# Altium schematic sheet PCB_DoAn_DK_nhietdo_dht11_ds18b20.SchDoc
size A0
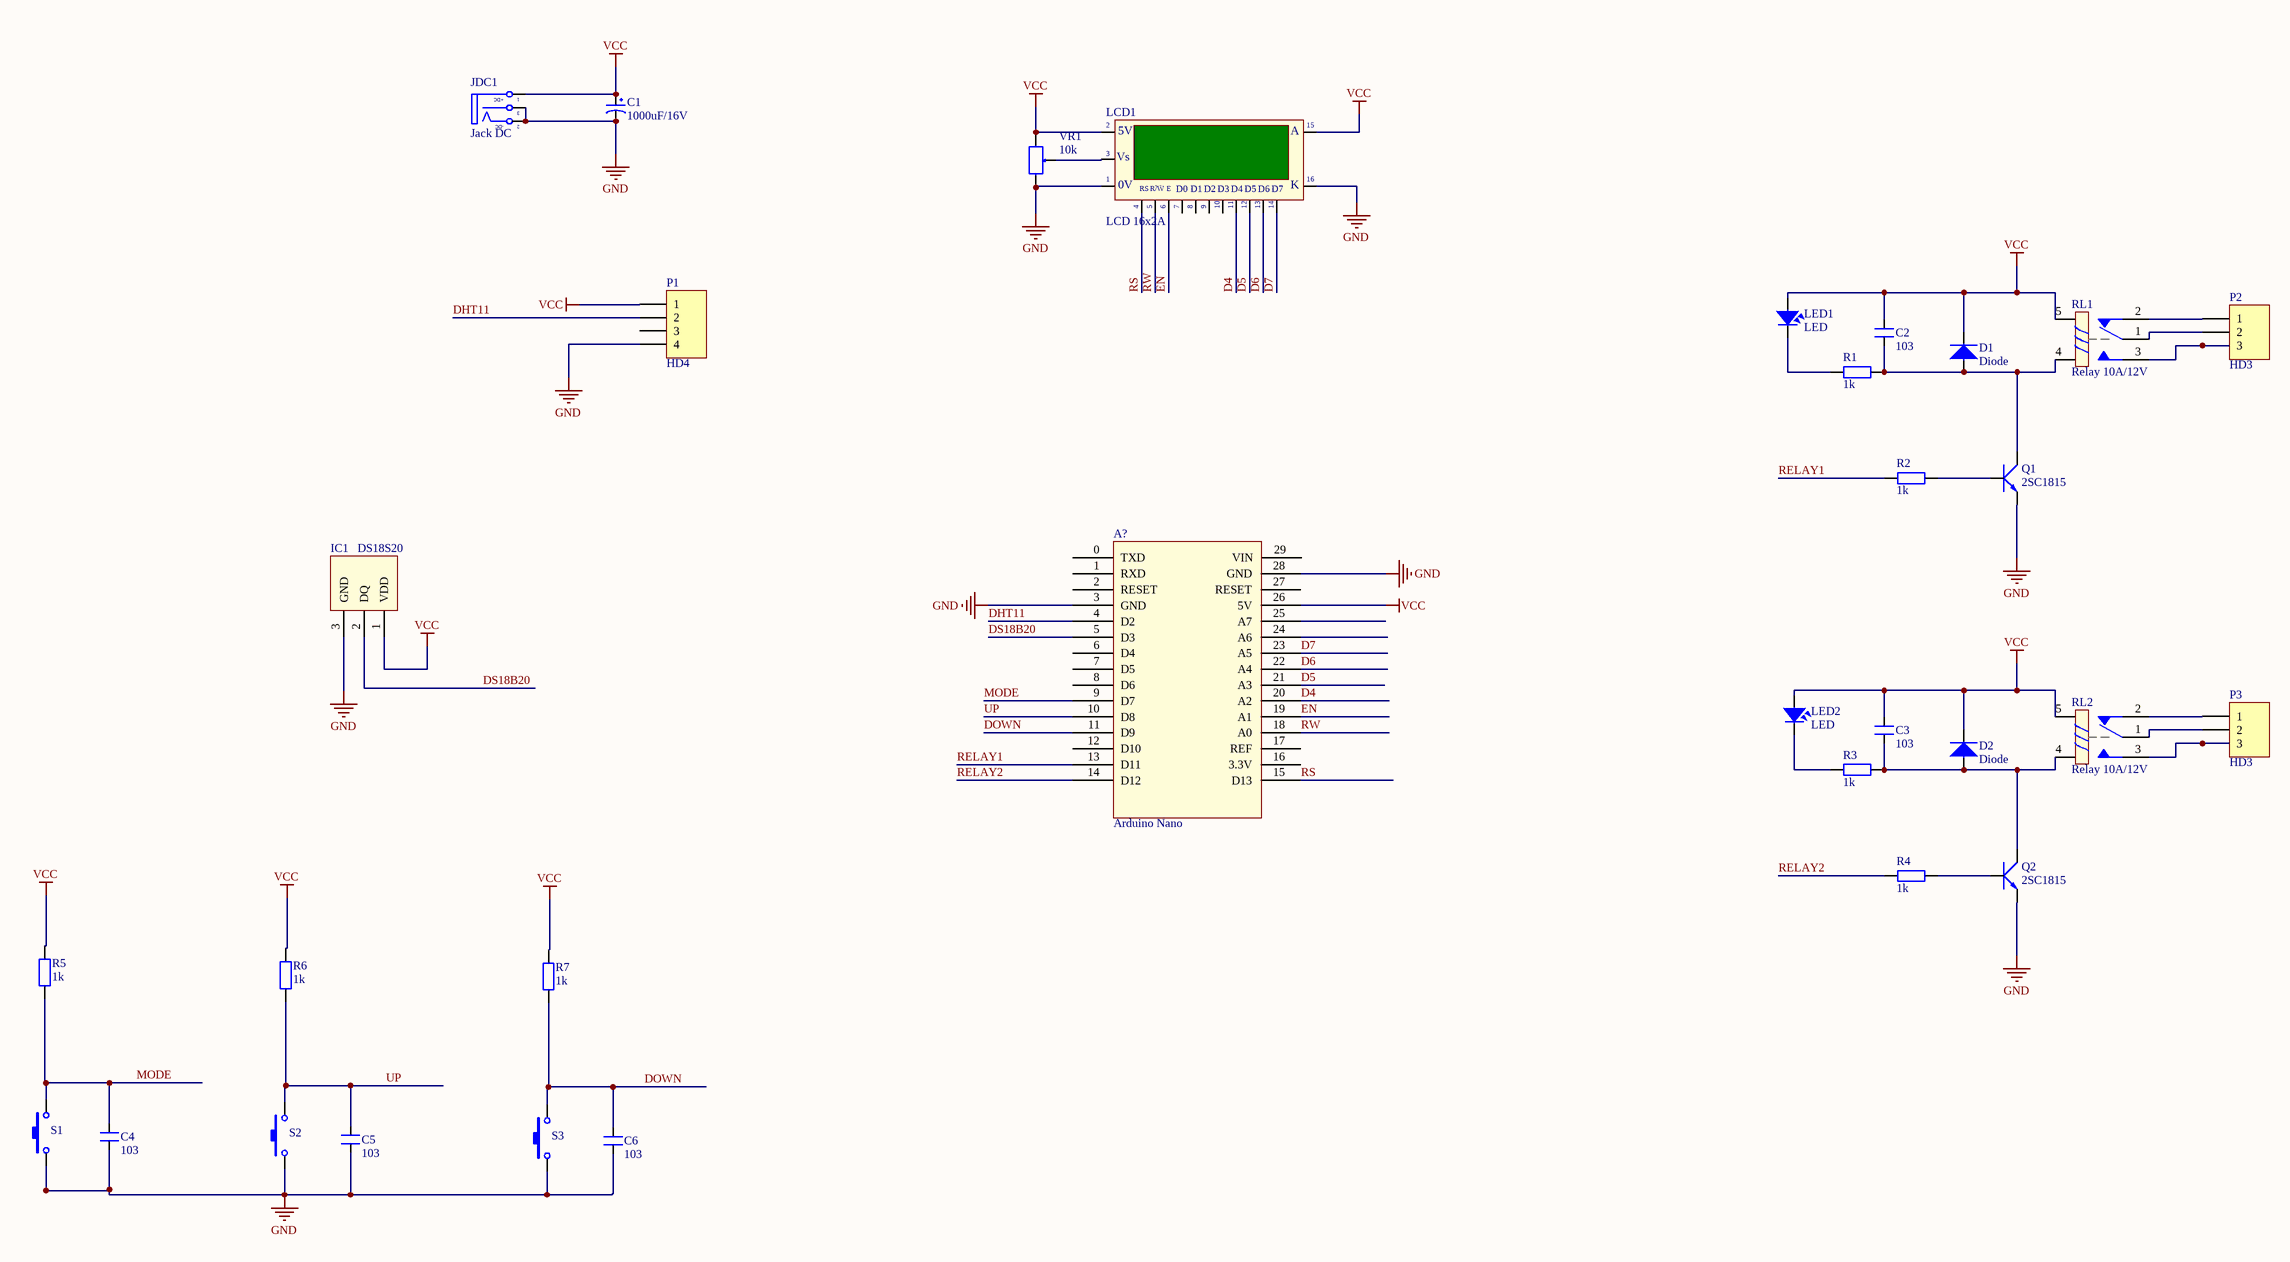
[diagram p0: PCB_DoAn_DK_nhietdo_dht11_ds18b20.SchDoc]

## Parts
A?  Arduino Nano  [Arduino Nano]
C1  1000uF/16V  [CP1.5/3.4]
C2  103  [SM-0805]
C3  103  [SM-0805]
C4  103  [SM-0805]
C5  103  [SM-0805]
C6  103  [SM-0805]
D1  Diode  [D1A]
D2  Diode  [D1A]
IC1  DS18S20  [JP3-C1T]
JDC1  Jack DC  [DC5]
LCD1  LCD 16x2A  [LCD16X2N]
LED1  LED  [LED-5-Green]
LED2  LED  [LED-5-Green]
P1  HD4  [HEADER 4]
P2  HD3  [CON 3]
P3  HD3  [CON 3]
Q1  2SC1815  [TO92-123]
Q2  2SC1815  [TO92-123]
R1  1k  [RES-SMD-0805]
R2  1k  [RES-SMD-0805]
R3  1k  [RES-SMD-0805]
R4  1k  [RES-SMD-0805]
R5  1k  [RES-1/4W]
R6  1k  [RES-1/4W]
R7  1k  [RES-1/4W]
RL1  Relay 10A/12V  [RL_SPDT_10A]
RL2  Relay 10A/12V  [RL_SPDT_10A]
S1  SW  [BUTTON  ROUND]  (value not drawn)
S2  SW  [BUTTON  ROUND]  (value not drawn)
S3  SW  [BUTTON  ROUND]  (value not drawn)
VR1  10k  [POT MODEL91A]

## Nets
GND: A?.3(GND) A?.28(GND) C1.2 C4.1 C5.1 C6.1 IC1.3(GND) JDC1.2(TN) JDC1.3(S) LCD1.1(GND) LCD1.16(K) P1.4 Q1.1(E) Q2.1(E) S1.1 S2.1 S3.1 VR1.3
VCC: A?.26(5V) C1.1 C2.2 C3.2 D1.2 D2.2 IC1.1(VDD) JDC1.1(T) LCD1.2(VDD) LCD1.15(A) LED1.1 LED2.1 P1.1 R5.2 R6.2 R7.2 RL1.5 RL2.5 VR1.1
D4: A?.20(A2) LCD1.11(D4)
D5: A?.21(A3) LCD1.12(D5)
D6: A?.22(A4) LCD1.13(D6)
D7: A?.23(A5) LCD1.14(D7)
DHT11: A?.4(D2) P1.2
DOWN: A?.11(D9) C6.2 R7.1 S3.2
DS18B20: A?.5(D3) IC1.2(DQ)
EN: A?.19(A1) LCD1.6(~{EN})
MODE: A?.9(D7) C4.2 R5.1 S1.2
RELAY1: A?.13(D11) R2.1
RELAY2: A?.14(D12) R4.1
RS: A?.15(D13) LCD1.4(RS)
RW: A?.18(A0) LCD1.5(R/~{W})
UP: A?.10(D8) C5.2 R6.1 S2.2
NetC2_1: C2.1 D1.1 Q1.2(C) R1.2 RL1.4
NetC3_1: C3.1 D2.1 Q2.2(C) R3.2 RL2.4
NetLCD1_3: LCD1.3(VEE) VR1.2
NetLED1_2: LED1.2 R1.1
NetLED2_2: LED2.2 R3.1
NetP2_1: P2.1 RL1.2
NetP2_2: P2.2 RL1.1
NetP2_3: P2.3 RL1.3
NetP3_1: P3.1 RL2.2
NetP3_2: P3.2 RL2.1
NetP3_3: P3.3 RL2.3
NetQ1_3: Q1.3(B) R2.2
NetQ2_3: Q2.3(B) R4.2

Not connected (* = marked no-connect by the designer): A? 0(TXD) 1(RXD) 2(RESET) 6(D4) 7(D5) 8(D6) 12(D10) 16(3.3V) 17(REF) 24(A6) 25(A7) 27(RESET) 29(VIN); LCD1 7(D0) 8(D1) 9(D2) 10(D3); P1 3

## Notes on the sheet
- (in symbol JACK_DC) +DC; -DC
- (in symbol LCD16x2A) 5V; Vs; |; 0V; R/W; E

## Library data of the parts
C1 = CP4: Cap 1000uF/16V - 220uF/50V; Description 5: 4,7uF>10uF/250V_3,3uF>10uF/400V - 2,2uF>4,7uF/450V; Description 1: 2200uF-3300uF/6,3V - 1000uF-2200uF/10V; Description 2: 1000uF/16V - 470uF => 1000uF/25V - 100uF/100V; Description 3: 330uF>470uF/35V_220uF>470uF/50V_10uF>22uF/250V; Description 4: 220uF => 330uF/63V - 10uF =>33uF/160 - 200V; Value: 1000uF/16V
C2-C6 = CM: Cap SMD; Value: 103
IC1 = DS18S20: High Precision  1-Wire® Digital Thermometer
JDC1 = JACK_DC
LCD1 = LCD16x2A: LCD dipslay 16 char, 2 line; Value: LCD16x2A
P1 = HEADER 4
P2 P3 = HEADER 3
Q1 Q2 = 2SC1815: NPN 600mW, ECB; Value: C1815
R1-R7 = R: Resistor R1/4W
RL1 RL2 = Relay 1: Relay SPDT,10A - 12VDC 5 Pin; Value: Relay SPDT, 10A, 12V
S1-S3 = SW-Button: Switch-Button; Published: 24-Mar-1999; LatestRevisionDate: 17-Jul-2002; LatestRevisionNote: Re-released for DXP Platform.; PackageReference: SPST-2; Publisher: Altium Limited
VR1 = Resistor Var